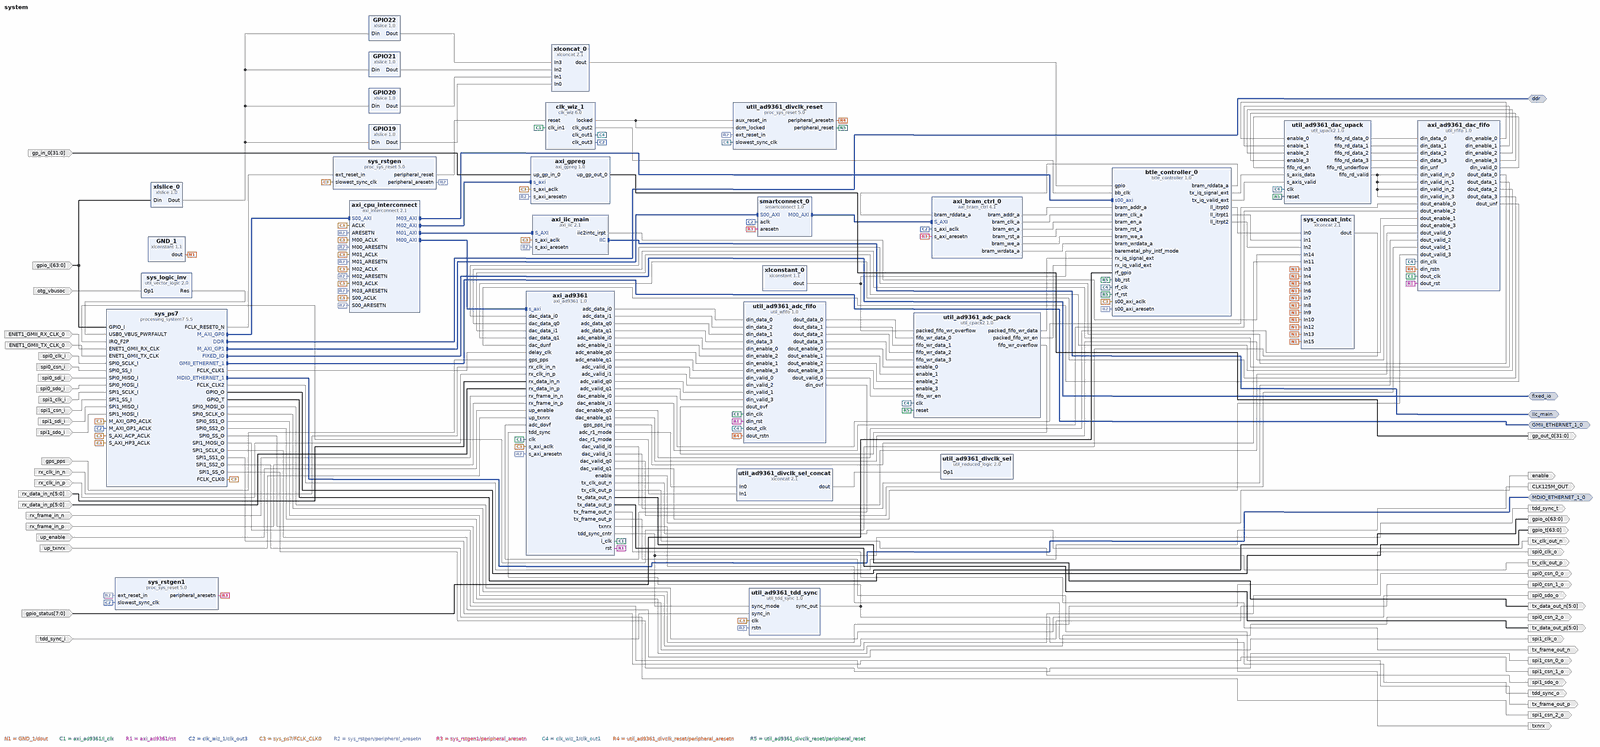
[diagram p0: block diagram of the top level, whole]
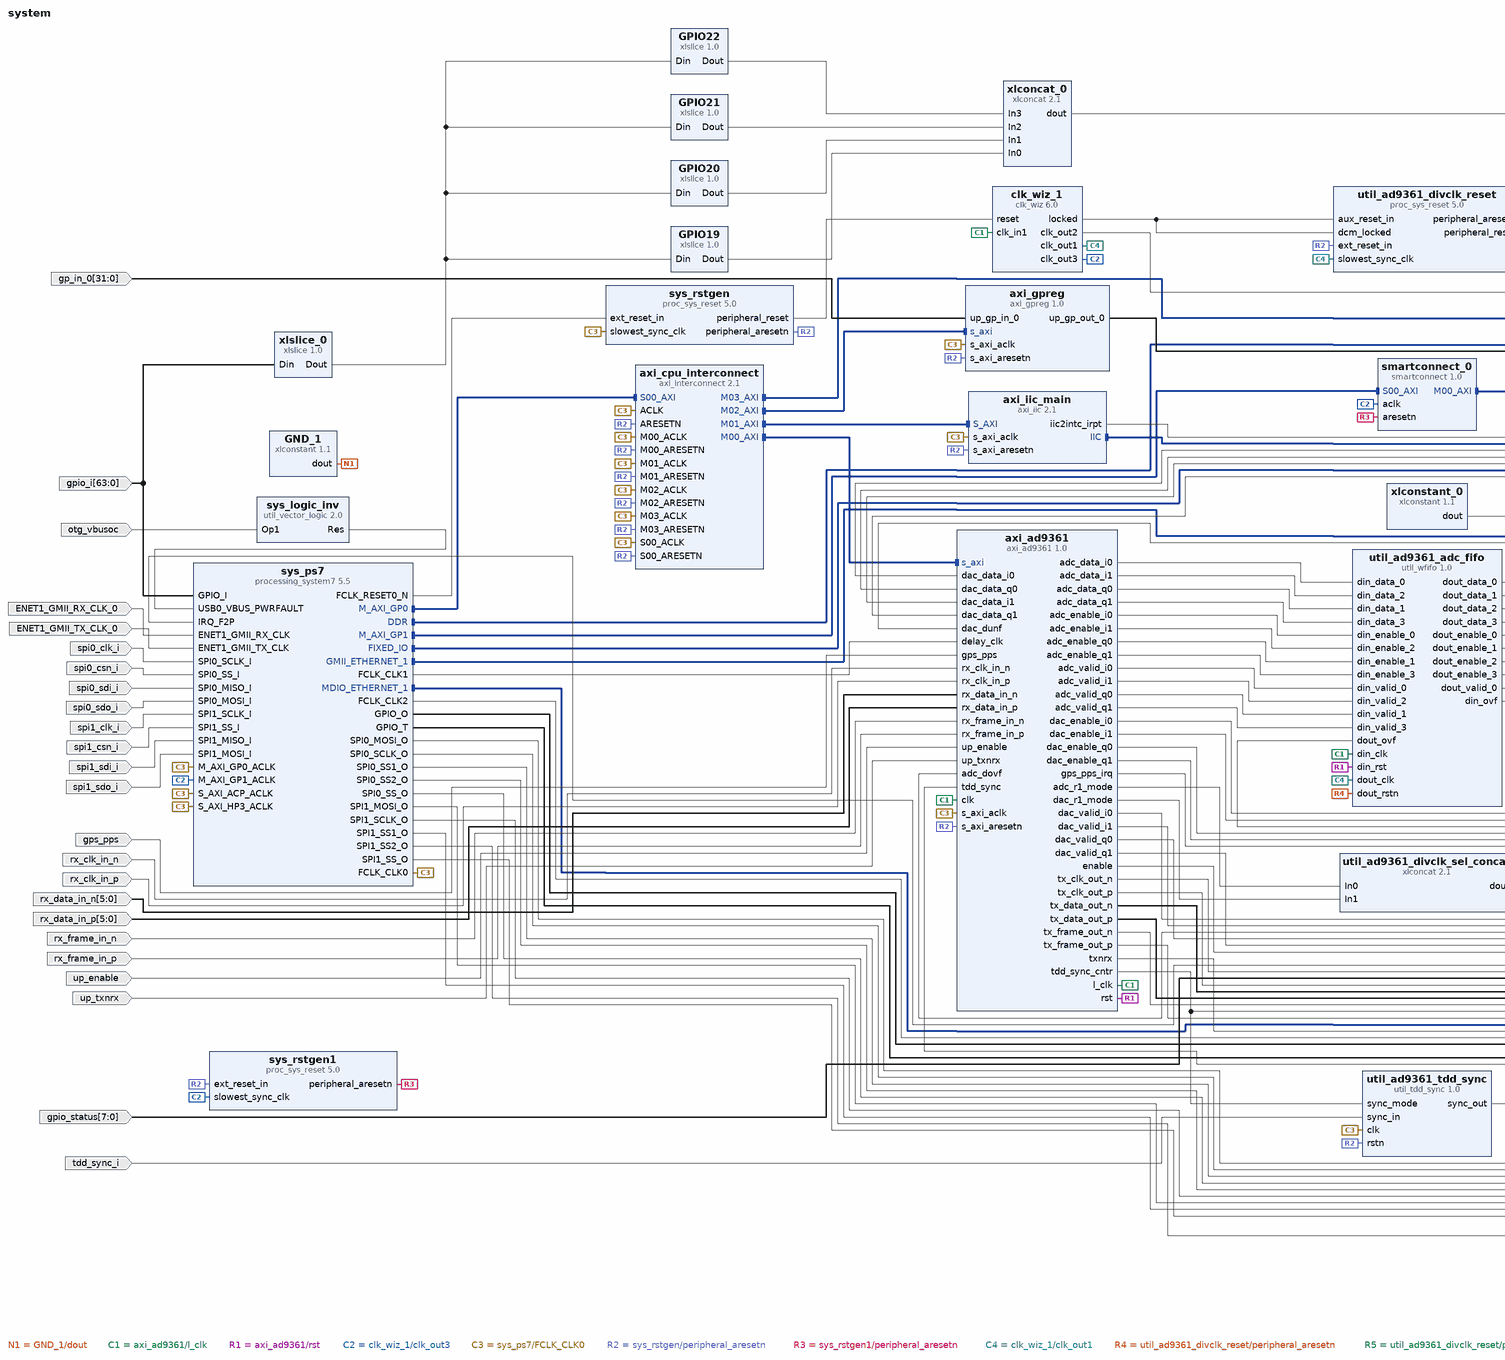
[diagram p1: block diagram of the top level, left part]
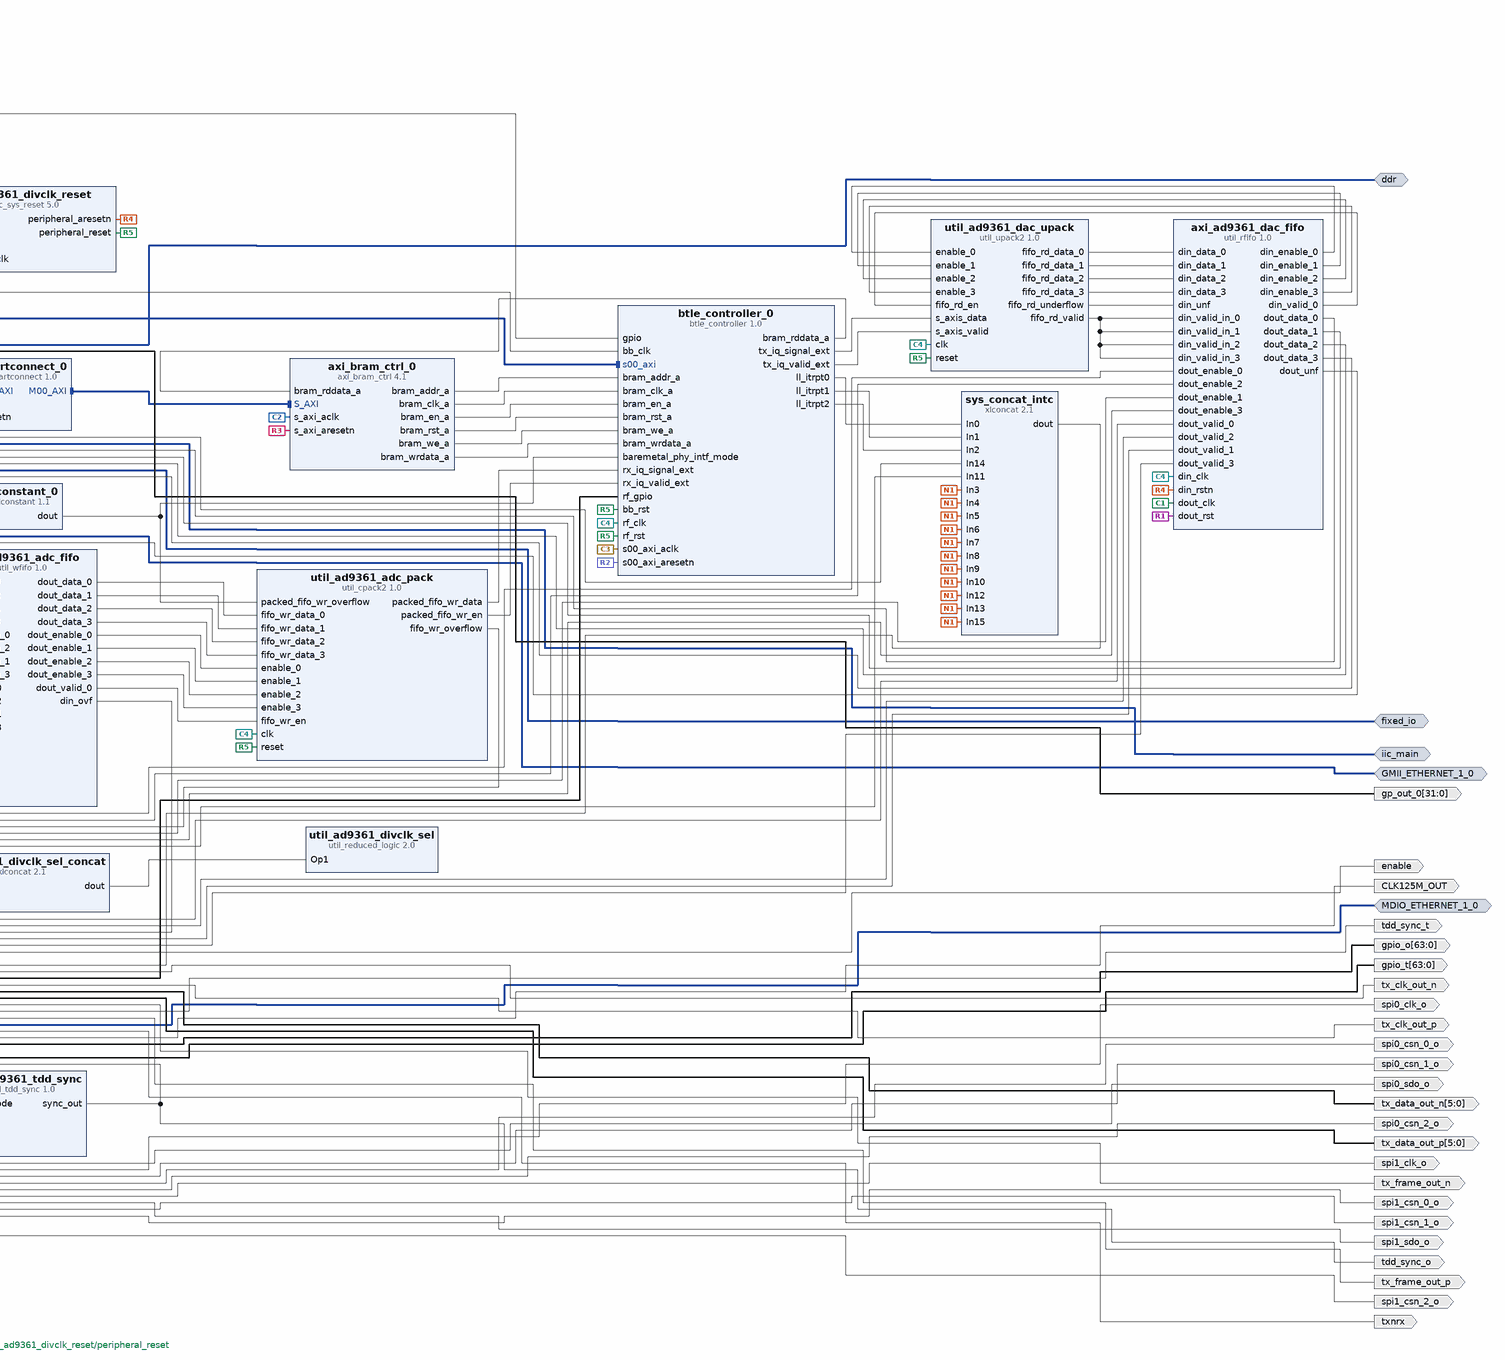
[diagram p2: block diagram of the top level, right part]
# Vivado block design system, xc7z020clg400-1, Vivado 2022.2
create_bd_design system

create_bd_intf_port -mode Master -vlnv xilinx.com:interface:ddrx_rtl:1.0 ddr
create_bd_intf_port -mode Master -vlnv xilinx.com:interface:iic_rtl:1.0 iic_main
create_bd_intf_port -mode Master -vlnv xilinx.com:display_processing_system7:fixedio_rtl:1.0 fixed_io
create_bd_intf_port -mode Master -vlnv xilinx.com:interface:gmii_rtl:1.0 GMII_ETHERNET_1_0
create_bd_intf_port -mode Master -vlnv xilinx.com:interface:mdio_rtl:1.0 MDIO_ETHERNET_1_0
create_bd_port -dir O spi0_csn_2_o
create_bd_port -dir O spi0_csn_1_o
create_bd_port -dir O spi0_csn_0_o
create_bd_port -dir I spi0_csn_i
create_bd_port -dir I spi0_clk_i
create_bd_port -dir O spi0_clk_o
create_bd_port -dir I spi0_sdo_i
create_bd_port -dir O spi0_sdo_o
create_bd_port -dir I spi0_sdi_i
create_bd_port -dir O spi1_csn_2_o
create_bd_port -dir O spi1_csn_1_o
create_bd_port -dir O spi1_csn_0_o
create_bd_port -dir I spi1_csn_i
create_bd_port -dir I spi1_clk_i
create_bd_port -dir O spi1_clk_o
create_bd_port -dir I spi1_sdo_i
create_bd_port -dir O spi1_sdo_o
create_bd_port -dir I spi1_sdi_i
create_bd_port -dir I -from 63 -to 0 gpio_i
create_bd_port -dir O -from 63 -to 0 gpio_o
create_bd_port -dir O -from 63 -to 0 gpio_t
create_bd_port -dir I otg_vbusoc
create_bd_port -dir O enable
create_bd_port -dir O txnrx
create_bd_port -dir I up_enable
create_bd_port -dir I up_txnrx
create_bd_port -dir O tdd_sync_o
create_bd_port -dir I tdd_sync_i
create_bd_port -dir O tdd_sync_t
create_bd_port -dir I gps_pps
create_bd_port -dir I -from 31 -to 0 gp_in_0
create_bd_port -dir O -from 31 -to 0 gp_out_0
create_bd_port -dir I rx_clk_in_p
create_bd_port -dir I rx_clk_in_n
create_bd_port -dir I rx_frame_in_p
create_bd_port -dir I rx_frame_in_n
create_bd_port -dir I -from 5 -to 0 rx_data_in_p
create_bd_port -dir I -from 5 -to 0 rx_data_in_n
create_bd_port -dir O tx_clk_out_p
create_bd_port -dir O tx_clk_out_n
create_bd_port -dir O tx_frame_out_p
create_bd_port -dir O tx_frame_out_n
create_bd_port -dir O -from 5 -to 0 tx_data_out_p
create_bd_port -dir O -from 5 -to 0 tx_data_out_n
create_bd_port -dir I -from 7 -to 0 gpio_status
create_bd_port -dir O CLK125M_OUT
create_bd_port -dir I -type clk ENET1_GMII_RX_CLK_0
create_bd_port -dir I -type clk ENET1_GMII_TX_CLK_0

create_bd_cell -type ip -vlnv xilinx.com:ip:processing_system7:5.5 sys_ps7
set_property -dict [list \
  CONFIG.PCW_ENET0_ENET0_IO {MIO 16 .. 27} \
  CONFIG.PCW_ENET0_GRP_MDIO_ENABLE 1 \
  CONFIG.PCW_ENET0_GRP_MDIO_IO {MIO 52 .. 53} \
  CONFIG.PCW_ENET0_PERIPHERAL_ENABLE 1 \
  CONFIG.PCW_ENET0_RESET_ENABLE 1 \
  CONFIG.PCW_ENET0_RESET_IO {MIO 46} \
  CONFIG.PCW_ENET1_ENET1_IO EMIO \
  CONFIG.PCW_ENET1_GRP_MDIO_ENABLE 1 \
  CONFIG.PCW_ENET1_GRP_MDIO_IO EMIO \
  CONFIG.PCW_ENET1_PERIPHERAL_ENABLE 1 \
  CONFIG.PCW_ENET1_RESET_ENABLE 1 \
  CONFIG.PCW_ENET1_RESET_IO {MIO 51} \
  CONFIG.PCW_ENET_RESET_ENABLE 1 \
  CONFIG.PCW_ENET_RESET_SELECT {Separate reset pins} \
  CONFIG.PCW_EN_CLK1_PORT 1 \
  CONFIG.PCW_EN_CLK2_PORT 1 \
  CONFIG.PCW_EN_RST1_PORT 1 \
  CONFIG.PCW_EN_RST2_PORT 1 \
  CONFIG.PCW_FCLK_CLK1_BUF TRUE \
  CONFIG.PCW_FCLK_CLK2_BUF TRUE \
  CONFIG.PCW_FPGA0_PERIPHERAL_FREQMHZ 100.0 \
  CONFIG.PCW_FPGA1_PERIPHERAL_FREQMHZ 200.0 \
  CONFIG.PCW_FPGA2_PERIPHERAL_FREQMHZ 125 \
  CONFIG.PCW_FPGA_FCLK1_ENABLE 1 \
  CONFIG.PCW_FPGA_FCLK2_ENABLE 1 \
  CONFIG.PCW_GPIO_EMIO_GPIO_ENABLE 1 \
  CONFIG.PCW_GPIO_EMIO_GPIO_IO 64 \
  CONFIG.PCW_GPIO_MIO_GPIO_ENABLE 1 \
  CONFIG.PCW_GPIO_MIO_GPIO_IO MIO \
  CONFIG.PCW_I2C_RESET_ENABLE 1 \
  CONFIG.PCW_IRQ_F2P_INTR 1 \
  CONFIG.PCW_IRQ_F2P_MODE REVERSE \
  CONFIG.PCW_M_AXI_GP1_ENABLE_STATIC_REMAP 1 \
  CONFIG.PCW_M_AXI_GP1_THREAD_ID_WIDTH 6 \
  CONFIG.PCW_PRESET_BANK1_VOLTAGE {LVCMOS 1.8V} \
  CONFIG.PCW_QSPI_GRP_SINGLE_SS_ENABLE 1 \
  CONFIG.PCW_QSPI_GRP_SINGLE_SS_IO {MIO 1 .. 6} \
  CONFIG.PCW_QSPI_PERIPHERAL_ENABLE 1 \
  CONFIG.PCW_QSPI_QSPI_IO {MIO 1 .. 6} \
  CONFIG.PCW_SD0_GRP_CD_ENABLE 0 \
  CONFIG.PCW_SD0_GRP_WP_ENABLE 0 \
  CONFIG.PCW_SD0_PERIPHERAL_ENABLE 1 \
  CONFIG.PCW_SD0_SD0_IO {MIO 40 .. 45} \
  CONFIG.PCW_SDIO_PERIPHERAL_FREQMHZ 50 \
  CONFIG.PCW_SINGLE_QSPI_DATA_MODE x4 \
  CONFIG.PCW_SPI0_PERIPHERAL_ENABLE 1 \
  CONFIG.PCW_SPI0_SPI0_IO EMIO \
  CONFIG.PCW_SPI1_PERIPHERAL_ENABLE 1 \
  CONFIG.PCW_SPI1_SPI1_IO EMIO \
  CONFIG.PCW_UART1_PERIPHERAL_ENABLE 1 \
  CONFIG.PCW_UART1_UART1_IO {MIO 48 .. 49} \
  CONFIG.PCW_UART_PERIPHERAL_FREQMHZ 100 \
  CONFIG.PCW_UIPARAM_DDR_PARTNO {MT41J256M16 RE-125} \
  CONFIG.PCW_USB0_PERIPHERAL_ENABLE 1 \
  CONFIG.PCW_USB0_RESET_ENABLE 1 \
  CONFIG.PCW_USB0_RESET_IO {MIO 47} \
  CONFIG.PCW_USB0_USB0_IO {MIO 28 .. 39} \
  CONFIG.PCW_USB_RESET_ENABLE 1 \
  CONFIG.PCW_USB_RESET_SELECT {Share reset pin} \
  CONFIG.PCW_USE_DEFAULT_ACP_USER_VAL 1 \
  CONFIG.PCW_USE_FABRIC_INTERRUPT 1 \
  CONFIG.PCW_USE_M_AXI_GP1 1 \
  CONFIG.PCW_USE_S_AXI_ACP 1 \
  CONFIG.PCW_USE_S_AXI_HP3 1 \
] [get_bd_cells sys_ps7]
# 238 more settings of sys_ps7 are not shown: defaults, MIO pin electricals, DDR timing, and values the tool derives
create_bd_cell -type ip -vlnv xilinx.com:ip:proc_sys_reset:5.0 sys_rstgen
set_property -dict {CONFIG.C_EXT_RST_WIDTH 1} [get_bd_cells sys_rstgen]
create_bd_cell -type ip -vlnv analog.com:user:axi_ad9361:1.0 axi_ad9361
set_property -dict [list \
  CONFIG.ADC_DATAFORMAT_DISABLE 0 \
  CONFIG.ADC_DATAPATH_DISABLE 0 \
  CONFIG.ADC_DCFILTER_DISABLE 0 \
  CONFIG.ADC_INIT_DELAY 30 \
  CONFIG.ADC_IQCORRECTION_DISABLE 0 \
  CONFIG.ADC_USERPORTS_DISABLE 0 \
  CONFIG.CMOS_OR_LVDS_N 0 \
  CONFIG.DAC_DATAPATH_DISABLE 0 \
  CONFIG.DAC_DDS_DISABLE 1 \
  CONFIG.DAC_IODELAY_ENABLE 0 \
  CONFIG.DAC_IQCORRECTION_DISABLE 0 \
  CONFIG.DAC_USERPORTS_DISABLE 0 \
  CONFIG.ID 0 \
  CONFIG.MIMO_ENABLE 1 \
  CONFIG.MODE_1R1T 0 \
  CONFIG.TDD_DISABLE 1 \
] [get_bd_cells axi_ad9361]
create_bd_cell -type ip -vlnv analog.com:user:util_tdd_sync:1.0 util_ad9361_tdd_sync
set_property -dict {CONFIG.TDD_SYNC_PERIOD 10000000} [get_bd_cells util_ad9361_tdd_sync]
create_bd_cell -type ip -vlnv xilinx.com:ip:util_reduced_logic:2.0 util_ad9361_divclk_sel
set_property -dict {CONFIG.C_SIZE 2} [get_bd_cells util_ad9361_divclk_sel]
create_bd_cell -type ip -vlnv xilinx.com:ip:proc_sys_reset:5.0 util_ad9361_divclk_reset
create_bd_cell -type ip -vlnv analog.com:user:util_wfifo:1.0 util_ad9361_adc_fifo
set_property -dict [list \
  CONFIG.DIN_ADDRESS_WIDTH 4 \
  CONFIG.DIN_DATA_WIDTH 16 \
  CONFIG.DOUT_DATA_WIDTH 16 \
  CONFIG.NUM_OF_CHANNELS 4 \
] [get_bd_cells util_ad9361_adc_fifo]
create_bd_cell -type ip -vlnv analog.com:user:util_cpack2:1.0 util_ad9361_adc_pack
set_property -dict {CONFIG.NUM_OF_CHANNELS 4 CONFIG.SAMPLE_DATA_WIDTH 16} [get_bd_cells util_ad9361_adc_pack]
create_bd_cell -type ip -vlnv analog.com:user:util_rfifo:1.0 axi_ad9361_dac_fifo
set_property -dict [list \
  CONFIG.DIN_ADDRESS_WIDTH 4 \
  CONFIG.DIN_DATA_WIDTH 16 \
  CONFIG.DOUT_DATA_WIDTH 16 \
] [get_bd_cells axi_ad9361_dac_fifo]
create_bd_cell -type ip -vlnv analog.com:user:util_upack2:1.0 util_ad9361_dac_upack
set_property -dict {CONFIG.NUM_OF_CHANNELS 4 CONFIG.SAMPLE_DATA_WIDTH 16} [get_bd_cells util_ad9361_dac_upack]
create_bd_cell -type ip -vlnv analog.com:user:axi_gpreg:1.0 axi_gpreg
set_property -dict {CONFIG.NUM_OF_CLK_MONS 0 CONFIG.NUM_OF_IO 1} [get_bd_cells axi_gpreg]
create_bd_cell -type ip -vlnv xilinx.com:ip:xlconstant:1.1 GND_1
set_property -dict {CONFIG.CONST_VAL 0 CONFIG.CONST_WIDTH 1} [get_bd_cells GND_1]
create_bd_cell -type ip -vlnv xilinx.com:ip:axi_interconnect:2.1 axi_cpu_interconnect
set_property -dict {CONFIG.NUM_MI 4} [get_bd_cells axi_cpu_interconnect]
create_bd_cell -type ip -vlnv xilinx.com:ip:axi_iic:2.1 axi_iic_main
set_property -dict {CONFIG.IIC_BOARD_INTERFACE Custom CONFIG.USE_BOARD_FLOW true} [get_bd_cells axi_iic_main]
create_bd_cell -type ip -vlnv xilinx.com:ip:xlconcat:2.1 sys_concat_intc
set_property -dict {CONFIG.NUM_PORTS 16 CONFIG.dout_width 16} [get_bd_cells sys_concat_intc]
create_bd_cell -type ip -vlnv xilinx.com:ip:util_vector_logic:2.0 sys_logic_inv
set_property -dict {CONFIG.C_OPERATION not CONFIG.C_SIZE 1} [get_bd_cells sys_logic_inv]
create_bd_cell -type ip -vlnv xilinx.com:ip:xlconcat:2.1 util_ad9361_divclk_sel_concat
set_property -dict {CONFIG.NUM_PORTS 2} [get_bd_cells util_ad9361_divclk_sel_concat]
create_bd_cell -type ip -vlnv user.org:user:btle_controller:1.0 btle_controller_0
create_bd_cell -type ip -vlnv xilinx.com:ip:xlconstant:1.1 xlconstant_0
set_property -dict {CONFIG.CONST_VAL 0} [get_bd_cells xlconstant_0]
create_bd_cell -type ip -vlnv xilinx.com:ip:xlslice:1.0 xlslice_0
set_property -dict {CONFIG.DIN_FROM 25 CONFIG.DIN_WIDTH 64} [get_bd_cells xlslice_0]
create_bd_cell -type ip -vlnv xilinx.com:ip:xlslice:1.0 GPIO21
set_property -dict {CONFIG.DIN_FROM 20 CONFIG.DIN_TO 20 CONFIG.DIN_WIDTH 26} [get_bd_cells GPIO21]
create_bd_cell -type ip -vlnv xilinx.com:ip:xlslice:1.0 GPIO22
set_property -dict {CONFIG.DIN_FROM 21 CONFIG.DIN_TO 21 CONFIG.DIN_WIDTH 26} [get_bd_cells GPIO22]
create_bd_cell -type ip -vlnv xilinx.com:ip:xlslice:1.0 GPIO20
set_property -dict {CONFIG.DIN_FROM 19 CONFIG.DIN_TO 19 CONFIG.DIN_WIDTH 26} [get_bd_cells GPIO20]
create_bd_cell -type ip -vlnv xilinx.com:ip:xlslice:1.0 GPIO19
set_property -dict {CONFIG.DIN_FROM 18 CONFIG.DIN_TO 18 CONFIG.DIN_WIDTH 26} [get_bd_cells GPIO19]
create_bd_cell -type ip -vlnv xilinx.com:ip:xlconcat:2.1 xlconcat_0
set_property -dict {CONFIG.NUM_PORTS 4} [get_bd_cells xlconcat_0]
create_bd_cell -type ip -vlnv xilinx.com:ip:clk_wiz:6.0 clk_wiz_1
set_property -dict [list \
  CONFIG.CLKIN1_JITTER_PS 312.5 \
  CONFIG.CLKOUT1_JITTER 434.696 \
  CONFIG.CLKOUT1_PHASE_ERROR 213.874 \
  CONFIG.CLKOUT1_REQUESTED_OUT_FREQ 8 \
  CONFIG.CLKOUT2_JITTER 379.346 \
  CONFIG.CLKOUT2_PHASE_ERROR 213.874 \
  CONFIG.CLKOUT2_REQUESTED_OUT_FREQ 16 \
  CONFIG.CLKOUT2_USED true \
  CONFIG.CLKOUT3_JITTER 185.867 \
  CONFIG.CLKOUT3_PHASE_ERROR 213.874 \
  CONFIG.CLKOUT3_REQUESTED_OUT_FREQ 192 \
  CONFIG.CLKOUT3_USED true \
  CONFIG.MMCM_CLKFBOUT_MULT_F 30.000 \
  CONFIG.MMCM_CLKIN1_PERIOD 31.250 \
  CONFIG.MMCM_CLKIN2_PERIOD 10.0 \
  CONFIG.MMCM_CLKOUT0_DIVIDE_F 120.000 \
  CONFIG.MMCM_CLKOUT1_DIVIDE 60 \
  CONFIG.MMCM_CLKOUT2_DIVIDE 5 \
  CONFIG.NUM_OUT_CLKS 3 \
  CONFIG.PRIM_IN_FREQ 32 \
] [get_bd_cells clk_wiz_1]
create_bd_cell -type ip -vlnv xilinx.com:ip:axi_bram_ctrl:4.1 axi_bram_ctrl_0
set_property -dict {CONFIG.READ_LATENCY 4 CONFIG.SINGLE_PORT_BRAM 1 CONFIG.SUPPORTS_NARROW_BURST 1} [get_bd_cells axi_bram_ctrl_0]
create_bd_cell -type ip -vlnv xilinx.com:ip:smartconnect:1.0 smartconnect_0
set_property -dict {CONFIG.NUM_SI 1} [get_bd_cells smartconnect_0]
create_bd_cell -type ip -vlnv xilinx.com:ip:proc_sys_reset:5.0 sys_rstgen1
set_property -dict {CONFIG.C_EXT_RST_WIDTH 1} [get_bd_cells sys_rstgen1]

# ---- connections ----

connect_bd_intf_net [get_bd_intf_pins axi_cpu_interconnect/S00_AXI] [get_bd_intf_pins sys_ps7/M_AXI_GP0]
connect_bd_intf_net [get_bd_intf_pins axi_ad9361/s_axi] [get_bd_intf_pins axi_cpu_interconnect/M00_AXI]
connect_bd_intf_net [get_bd_intf_pins axi_cpu_interconnect/M01_AXI] [get_bd_intf_pins axi_iic_main/S_AXI]
connect_bd_intf_net [get_bd_intf_pins axi_gpreg/s_axi] [get_bd_intf_pins axi_cpu_interconnect/M02_AXI]
connect_bd_intf_net [get_bd_intf_pins btle_controller_0/s00_axi] [get_bd_intf_pins axi_cpu_interconnect/M03_AXI]
connect_bd_intf_net [get_bd_intf_ports iic_main] [get_bd_intf_pins axi_iic_main/IIC]
connect_bd_intf_net [get_bd_intf_pins smartconnect_0/M00_AXI] [get_bd_intf_pins axi_bram_ctrl_0/S_AXI]
connect_bd_intf_net [get_bd_intf_ports ddr] [get_bd_intf_pins sys_ps7/DDR]
connect_bd_intf_net [get_bd_intf_ports fixed_io] [get_bd_intf_pins sys_ps7/FIXED_IO]
connect_bd_intf_net [get_bd_intf_ports GMII_ETHERNET_1_0] [get_bd_intf_pins sys_ps7/GMII_ETHERNET_1]
connect_bd_intf_net [get_bd_intf_ports MDIO_ETHERNET_1_0] [get_bd_intf_pins sys_ps7/MDIO_ETHERNET_1]
connect_bd_intf_net [get_bd_intf_pins smartconnect_0/S00_AXI] [get_bd_intf_pins sys_ps7/M_AXI_GP1]
connect_bd_net -net ENET1_GMII_RX_CLK_0_1 [get_bd_ports ENET1_GMII_RX_CLK_0] [get_bd_pins sys_ps7/ENET1_GMII_RX_CLK]
connect_bd_net -net ENET1_GMII_TX_CLK_0_1 [get_bd_ports ENET1_GMII_TX_CLK_0] [get_bd_pins sys_ps7/ENET1_GMII_TX_CLK]
connect_bd_net [get_bd_pins GND_1/dout] \
  [get_bd_pins sys_concat_intc/In8] [get_bd_pins sys_concat_intc/In9] [get_bd_pins sys_concat_intc/In10] \
  [get_bd_pins sys_concat_intc/In15] [get_bd_pins sys_concat_intc/In13] [get_bd_pins sys_concat_intc/In12] \
  [get_bd_pins sys_concat_intc/In4] [get_bd_pins sys_concat_intc/In5] [get_bd_pins sys_concat_intc/In6] \
  [get_bd_pins sys_concat_intc/In3] [get_bd_pins sys_concat_intc/In7]
connect_bd_net [get_bd_pins GPIO19/Dout] [get_bd_pins xlconcat_0/In0]
connect_bd_net [get_bd_pins GPIO20/Dout] [get_bd_pins xlconcat_0/In1]
connect_bd_net [get_bd_pins GPIO21/Dout] [get_bd_pins xlconcat_0/In2]
connect_bd_net [get_bd_pins GPIO22/Dout] [get_bd_pins xlconcat_0/In3]
connect_bd_net [get_bd_pins axi_ad9361/adc_data_i0] [get_bd_pins util_ad9361_adc_fifo/din_data_0]
connect_bd_net [get_bd_pins axi_ad9361/adc_data_i1] [get_bd_pins util_ad9361_adc_fifo/din_data_2]
connect_bd_net [get_bd_pins axi_ad9361/adc_data_q0] [get_bd_pins util_ad9361_adc_fifo/din_data_1]
connect_bd_net [get_bd_pins axi_ad9361/adc_data_q1] [get_bd_pins util_ad9361_adc_fifo/din_data_3]
connect_bd_net [get_bd_pins axi_ad9361/adc_enable_i0] [get_bd_pins util_ad9361_adc_fifo/din_enable_0]
connect_bd_net [get_bd_pins axi_ad9361/adc_enable_i1] [get_bd_pins util_ad9361_adc_fifo/din_enable_2]
connect_bd_net [get_bd_pins axi_ad9361/adc_enable_q0] [get_bd_pins util_ad9361_adc_fifo/din_enable_1]
connect_bd_net [get_bd_pins axi_ad9361/adc_enable_q1] [get_bd_pins util_ad9361_adc_fifo/din_enable_3]
connect_bd_net [get_bd_pins axi_ad9361/adc_r1_mode] [get_bd_pins util_ad9361_divclk_sel_concat/In0]
connect_bd_net [get_bd_pins axi_ad9361/adc_valid_i0] [get_bd_pins util_ad9361_adc_fifo/din_valid_0]
connect_bd_net [get_bd_pins axi_ad9361/adc_valid_i1] [get_bd_pins util_ad9361_adc_fifo/din_valid_2]
connect_bd_net [get_bd_pins axi_ad9361/adc_valid_q0] [get_bd_pins util_ad9361_adc_fifo/din_valid_1]
connect_bd_net [get_bd_pins axi_ad9361/adc_valid_q1] [get_bd_pins util_ad9361_adc_fifo/din_valid_3]
connect_bd_net [get_bd_pins axi_ad9361/dac_enable_i0] [get_bd_pins axi_ad9361_dac_fifo/dout_enable_0]
connect_bd_net [get_bd_pins axi_ad9361/dac_enable_i1] [get_bd_pins axi_ad9361_dac_fifo/dout_enable_2]
connect_bd_net [get_bd_pins axi_ad9361/dac_enable_q0] [get_bd_pins axi_ad9361_dac_fifo/dout_enable_1]
connect_bd_net [get_bd_pins axi_ad9361/dac_enable_q1] [get_bd_pins axi_ad9361_dac_fifo/dout_enable_3]
connect_bd_net [get_bd_pins axi_ad9361_dac_fifo/din_enable_0] [get_bd_pins util_ad9361_dac_upack/enable_0]
connect_bd_net [get_bd_pins axi_ad9361_dac_fifo/din_enable_1] [get_bd_pins util_ad9361_dac_upack/enable_1]
connect_bd_net [get_bd_pins axi_ad9361_dac_fifo/din_enable_2] [get_bd_pins util_ad9361_dac_upack/enable_2]
connect_bd_net [get_bd_pins axi_ad9361_dac_fifo/din_enable_3] [get_bd_pins util_ad9361_dac_upack/enable_3]
connect_bd_net [get_bd_pins axi_ad9361_dac_fifo/din_valid_0] [get_bd_pins util_ad9361_dac_upack/fifo_rd_en]
connect_bd_net [get_bd_pins axi_ad9361_dac_fifo/dout_data_0] [get_bd_pins axi_ad9361/dac_data_i0]
connect_bd_net [get_bd_pins axi_ad9361_dac_fifo/dout_data_1] [get_bd_pins axi_ad9361/dac_data_q0]
connect_bd_net [get_bd_pins axi_ad9361_dac_fifo/dout_data_2] [get_bd_pins axi_ad9361/dac_data_i1]
connect_bd_net [get_bd_pins axi_ad9361_dac_fifo/dout_data_3] [get_bd_pins axi_ad9361/dac_data_q1]
connect_bd_net [get_bd_pins axi_ad9361_dac_fifo/dout_unf] [get_bd_pins axi_ad9361/dac_dunf]
connect_bd_net [get_bd_pins axi_ad9361/dac_r1_mode] [get_bd_pins util_ad9361_divclk_sel_concat/In1]
connect_bd_net [get_bd_pins axi_ad9361/dac_valid_i0] [get_bd_pins axi_ad9361_dac_fifo/dout_valid_0]
connect_bd_net [get_bd_pins axi_ad9361/dac_valid_i1] [get_bd_pins axi_ad9361_dac_fifo/dout_valid_2]
connect_bd_net [get_bd_pins axi_ad9361/dac_valid_q0] [get_bd_pins axi_ad9361_dac_fifo/dout_valid_1]
connect_bd_net [get_bd_pins axi_ad9361/dac_valid_q1] [get_bd_pins axi_ad9361_dac_fifo/dout_valid_3]
connect_bd_net [get_bd_pins axi_ad9361/enable] [get_bd_ports enable]
connect_bd_net [get_bd_pins axi_ad9361/gps_pps_irq] [get_bd_pins sys_concat_intc/In11]
connect_bd_net [get_bd_pins axi_ad9361/l_clk] \
  [get_bd_pins axi_ad9361/clk] [get_bd_pins util_ad9361_adc_fifo/din_clk] [get_bd_pins axi_ad9361_dac_fifo/dout_clk] \
  [get_bd_pins clk_wiz_1/clk_in1]
connect_bd_net [get_bd_pins axi_ad9361/rst] [get_bd_pins util_ad9361_adc_fifo/din_rst] [get_bd_pins axi_ad9361_dac_fifo/dout_rst]
connect_bd_net [get_bd_pins axi_ad9361/tdd_sync_cntr] [get_bd_pins util_ad9361_tdd_sync/sync_mode] [get_bd_ports tdd_sync_t]
connect_bd_net [get_bd_pins axi_ad9361/tx_clk_out_n] [get_bd_ports tx_clk_out_n]
connect_bd_net [get_bd_pins axi_ad9361/tx_clk_out_p] [get_bd_ports tx_clk_out_p]
connect_bd_net [get_bd_pins axi_ad9361/tx_data_out_n] [get_bd_ports tx_data_out_n]
connect_bd_net [get_bd_pins axi_ad9361/tx_data_out_p] [get_bd_ports tx_data_out_p]
connect_bd_net [get_bd_pins axi_ad9361/tx_frame_out_n] [get_bd_ports tx_frame_out_n]
connect_bd_net [get_bd_pins axi_ad9361/tx_frame_out_p] [get_bd_ports tx_frame_out_p]
connect_bd_net [get_bd_pins axi_ad9361/txnrx] [get_bd_ports txnrx]
connect_bd_net [get_bd_pins axi_bram_ctrl_0/bram_addr_a] [get_bd_pins btle_controller_0/bram_addr_a]
connect_bd_net [get_bd_pins axi_bram_ctrl_0/bram_clk_a] [get_bd_pins btle_controller_0/bram_clk_a]
connect_bd_net [get_bd_pins axi_bram_ctrl_0/bram_en_a] [get_bd_pins btle_controller_0/bram_en_a]
connect_bd_net [get_bd_pins axi_bram_ctrl_0/bram_rst_a] [get_bd_pins btle_controller_0/bram_rst_a]
connect_bd_net [get_bd_pins axi_bram_ctrl_0/bram_we_a] [get_bd_pins btle_controller_0/bram_we_a]
connect_bd_net [get_bd_pins axi_bram_ctrl_0/bram_wrdata_a] [get_bd_pins btle_controller_0/bram_wrdata_a]
connect_bd_net [get_bd_pins axi_gpreg/up_gp_out_0] [get_bd_ports gp_out_0]
connect_bd_net [get_bd_pins axi_iic_main/iic2intc_irpt] [get_bd_pins sys_concat_intc/In14]
connect_bd_net [get_bd_pins btle_controller_0/bram_rddata_a] [get_bd_pins axi_bram_ctrl_0/bram_rddata_a]
connect_bd_net [get_bd_pins btle_controller_0/ll_itrpt0] [get_bd_pins sys_concat_intc/In0]
connect_bd_net [get_bd_pins btle_controller_0/ll_itrpt1] [get_bd_pins sys_concat_intc/In1]
connect_bd_net [get_bd_pins btle_controller_0/ll_itrpt2] [get_bd_pins sys_concat_intc/In2]
connect_bd_net -net btle_controller_0_tx_iq_signal [get_bd_pins btle_controller_0/tx_iq_signal_ext] [get_bd_pins util_ad9361_dac_upack/s_axis_data]
connect_bd_net -net btle_controller_0_tx_iq_valid [get_bd_pins btle_controller_0/tx_iq_valid_ext] [get_bd_pins util_ad9361_dac_upack/s_axis_valid]
connect_bd_net -net clk_wiz_0_locked [get_bd_pins clk_wiz_1/locked] \
  [get_bd_pins util_ad9361_divclk_reset/aux_reset_in] [get_bd_pins util_ad9361_divclk_reset/dcm_locked]
connect_bd_net [get_bd_pins clk_wiz_1/clk_out2] [get_bd_pins btle_controller_0/bb_clk]
connect_bd_net [get_bd_pins clk_wiz_1/clk_out3] \
  [get_bd_pins sys_rstgen1/slowest_sync_clk] [get_bd_pins smartconnect_0/aclk] [get_bd_pins axi_bram_ctrl_0/s_axi_aclk] \
  [get_bd_pins sys_ps7/M_AXI_GP1_ACLK]
connect_bd_net -net gp_in_0_1 [get_bd_ports gp_in_0] [get_bd_pins axi_gpreg/up_gp_in_0]
connect_bd_net [get_bd_ports gpio_i] [get_bd_pins sys_ps7/GPIO_I] [get_bd_pins xlslice_0/Din]
connect_bd_net [get_bd_ports gpio_status] [get_bd_pins btle_controller_0/rf_gpio]
connect_bd_net [get_bd_ports gps_pps] [get_bd_pins axi_ad9361/gps_pps]
connect_bd_net [get_bd_ports otg_vbusoc] [get_bd_pins sys_logic_inv/Op1]
connect_bd_net [get_bd_ports rx_clk_in_n] [get_bd_pins axi_ad9361/rx_clk_in_n]
connect_bd_net [get_bd_ports rx_clk_in_p] [get_bd_pins axi_ad9361/rx_clk_in_p]
connect_bd_net [get_bd_ports rx_data_in_n] [get_bd_pins axi_ad9361/rx_data_in_n]
connect_bd_net [get_bd_ports rx_data_in_p] [get_bd_pins axi_ad9361/rx_data_in_p]
connect_bd_net [get_bd_ports rx_frame_in_n] [get_bd_pins axi_ad9361/rx_frame_in_n]
connect_bd_net [get_bd_ports rx_frame_in_p] [get_bd_pins axi_ad9361/rx_frame_in_p]
connect_bd_net [get_bd_ports spi0_clk_i] [get_bd_pins sys_ps7/SPI0_SCLK_I]
connect_bd_net [get_bd_ports spi0_csn_i] [get_bd_pins sys_ps7/SPI0_SS_I]
connect_bd_net [get_bd_ports spi0_sdi_i] [get_bd_pins sys_ps7/SPI0_MISO_I]
connect_bd_net [get_bd_ports spi0_sdo_i] [get_bd_pins sys_ps7/SPI0_MOSI_I]
connect_bd_net [get_bd_ports spi1_clk_i] [get_bd_pins sys_ps7/SPI1_SCLK_I]
connect_bd_net [get_bd_ports spi1_csn_i] [get_bd_pins sys_ps7/SPI1_SS_I]
connect_bd_net [get_bd_ports spi1_sdi_i] [get_bd_pins sys_ps7/SPI1_MISO_I]
connect_bd_net [get_bd_ports spi1_sdo_i] [get_bd_pins sys_ps7/SPI1_MOSI_I]
connect_bd_net -net sys_200m_clk [get_bd_pins sys_ps7/FCLK_CLK1] [get_bd_pins axi_ad9361/delay_clk]
connect_bd_net [get_bd_pins sys_concat_intc/dout] [get_bd_pins sys_ps7/IRQ_F2P]
connect_bd_net -net sys_cpu_clk [get_bd_pins sys_ps7/FCLK_CLK0] \
  [get_bd_pins sys_rstgen/slowest_sync_clk] [get_bd_pins sys_ps7/M_AXI_GP0_ACLK] [get_bd_pins util_ad9361_tdd_sync/clk] \
  [get_bd_pins axi_ad9361/s_axi_aclk] [get_bd_pins axi_gpreg/s_axi_aclk] [get_bd_pins axi_cpu_interconnect/ACLK] \
  [get_bd_pins axi_cpu_interconnect/S00_ACLK] [get_bd_pins axi_cpu_interconnect/M00_ACLK] \
  [get_bd_pins axi_cpu_interconnect/M01_ACLK] [get_bd_pins axi_cpu_interconnect/M02_ACLK] \
  [get_bd_pins axi_iic_main/s_axi_aclk] [get_bd_pins sys_ps7/S_AXI_ACP_ACLK] [get_bd_pins sys_ps7/S_AXI_HP3_ACLK] \
  [get_bd_pins axi_cpu_interconnect/M03_ACLK] [get_bd_pins btle_controller_0/s00_axi_aclk]
connect_bd_net -net sys_cpu_resetn [get_bd_pins sys_rstgen/peripheral_aresetn] \
  [get_bd_pins util_ad9361_tdd_sync/rstn] [get_bd_pins util_ad9361_divclk_reset/ext_reset_in] \
  [get_bd_pins axi_ad9361/s_axi_aresetn] [get_bd_pins axi_gpreg/s_axi_aresetn] [get_bd_pins axi_cpu_interconnect/ARESETN] \
  [get_bd_pins axi_cpu_interconnect/S00_ARESETN] [get_bd_pins axi_cpu_interconnect/M00_ARESETN] \
  [get_bd_pins axi_cpu_interconnect/M01_ARESETN] [get_bd_pins axi_cpu_interconnect/M02_ARESETN] \
  [get_bd_pins axi_iic_main/s_axi_aresetn] [get_bd_pins axi_cpu_interconnect/M03_ARESETN] \
  [get_bd_pins btle_controller_0/s00_axi_aresetn] [get_bd_pins sys_rstgen1/ext_reset_in]
connect_bd_net [get_bd_pins sys_logic_inv/Res] [get_bd_pins sys_ps7/USB0_VBUS_PWRFAULT]
connect_bd_net [get_bd_pins sys_ps7/FCLK_CLK2] [get_bd_ports CLK125M_OUT]
connect_bd_net [get_bd_pins sys_ps7/FCLK_RESET0_N] [get_bd_pins sys_rstgen/ext_reset_in]
connect_bd_net [get_bd_pins sys_ps7/GPIO_O] [get_bd_ports gpio_o]
connect_bd_net [get_bd_pins sys_ps7/GPIO_T] [get_bd_ports gpio_t]
connect_bd_net [get_bd_pins sys_ps7/SPI0_MOSI_O] [get_bd_ports spi0_sdo_o]
connect_bd_net [get_bd_pins sys_ps7/SPI0_SCLK_O] [get_bd_ports spi0_clk_o]
connect_bd_net [get_bd_pins sys_ps7/SPI0_SS1_O] [get_bd_ports spi0_csn_1_o]
connect_bd_net [get_bd_pins sys_ps7/SPI0_SS2_O] [get_bd_ports spi0_csn_2_o]
connect_bd_net [get_bd_pins sys_ps7/SPI0_SS_O] [get_bd_ports spi0_csn_0_o]
connect_bd_net [get_bd_pins sys_ps7/SPI1_MOSI_O] [get_bd_ports spi1_sdo_o]
connect_bd_net [get_bd_pins sys_ps7/SPI1_SCLK_O] [get_bd_ports spi1_clk_o]
connect_bd_net [get_bd_pins sys_ps7/SPI1_SS1_O] [get_bd_ports spi1_csn_1_o]
connect_bd_net [get_bd_pins sys_ps7/SPI1_SS2_O] [get_bd_ports spi1_csn_2_o]
connect_bd_net [get_bd_pins sys_ps7/SPI1_SS_O] [get_bd_ports spi1_csn_0_o]
connect_bd_net [get_bd_pins sys_rstgen1/peripheral_aresetn] [get_bd_pins smartconnect_0/aresetn] [get_bd_pins axi_bram_ctrl_0/s_axi_aresetn]
connect_bd_net [get_bd_pins sys_rstgen/peripheral_reset] [get_bd_pins clk_wiz_1/reset]
connect_bd_net [get_bd_ports tdd_sync_i] [get_bd_pins util_ad9361_tdd_sync/sync_in]
connect_bd_net [get_bd_ports up_enable] [get_bd_pins axi_ad9361/up_enable]
connect_bd_net [get_bd_ports up_txnrx] [get_bd_pins axi_ad9361/up_txnrx]
connect_bd_net [get_bd_pins util_ad9361_adc_fifo/din_ovf] [get_bd_pins axi_ad9361/adc_dovf]
connect_bd_net [get_bd_pins util_ad9361_adc_fifo/dout_data_0] [get_bd_pins util_ad9361_adc_pack/fifo_wr_data_0]
connect_bd_net [get_bd_pins util_ad9361_adc_fifo/dout_data_1] [get_bd_pins util_ad9361_adc_pack/fifo_wr_data_1]
connect_bd_net [get_bd_pins util_ad9361_adc_fifo/dout_data_2] [get_bd_pins util_ad9361_adc_pack/fifo_wr_data_2]
connect_bd_net [get_bd_pins util_ad9361_adc_fifo/dout_data_3] [get_bd_pins util_ad9361_adc_pack/fifo_wr_data_3]
connect_bd_net [get_bd_pins util_ad9361_adc_fifo/dout_enable_0] [get_bd_pins util_ad9361_adc_pack/enable_0]
connect_bd_net [get_bd_pins util_ad9361_adc_fifo/dout_enable_1] [get_bd_pins util_ad9361_adc_pack/enable_1]
connect_bd_net [get_bd_pins util_ad9361_adc_fifo/dout_enable_2] [get_bd_pins util_ad9361_adc_pack/enable_2]
connect_bd_net [get_bd_pins util_ad9361_adc_fifo/dout_enable_3] [get_bd_pins util_ad9361_adc_pack/enable_3]
connect_bd_net [get_bd_pins util_ad9361_adc_fifo/dout_valid_0] [get_bd_pins util_ad9361_adc_pack/fifo_wr_en]
connect_bd_net [get_bd_pins util_ad9361_adc_pack/fifo_wr_overflow] [get_bd_pins util_ad9361_adc_fifo/dout_ovf]
connect_bd_net [get_bd_pins util_ad9361_adc_pack/packed_fifo_wr_data] [get_bd_pins btle_controller_0/rx_iq_signal_ext]
connect_bd_net [get_bd_pins util_ad9361_adc_pack/packed_fifo_wr_en] [get_bd_pins btle_controller_0/rx_iq_valid_ext]
connect_bd_net [get_bd_pins util_ad9361_dac_upack/fifo_rd_data_0] [get_bd_pins axi_ad9361_dac_fifo/din_data_0]
connect_bd_net [get_bd_pins util_ad9361_dac_upack/fifo_rd_data_1] [get_bd_pins axi_ad9361_dac_fifo/din_data_1]
connect_bd_net [get_bd_pins util_ad9361_dac_upack/fifo_rd_data_2] [get_bd_pins axi_ad9361_dac_fifo/din_data_2]
connect_bd_net [get_bd_pins util_ad9361_dac_upack/fifo_rd_data_3] [get_bd_pins axi_ad9361_dac_fifo/din_data_3]
connect_bd_net [get_bd_pins util_ad9361_dac_upack/fifo_rd_underflow] [get_bd_pins axi_ad9361_dac_fifo/din_unf]
connect_bd_net [get_bd_pins util_ad9361_dac_upack/fifo_rd_valid] \
  [get_bd_pins axi_ad9361_dac_fifo/din_valid_in_0] [get_bd_pins axi_ad9361_dac_fifo/din_valid_in_1] \
  [get_bd_pins axi_ad9361_dac_fifo/din_valid_in_2] [get_bd_pins axi_ad9361_dac_fifo/din_valid_in_3]
connect_bd_net -net util_ad9361_divclk_clk_out [get_bd_pins clk_wiz_1/clk_out1] \
  [get_bd_pins util_ad9361_divclk_reset/slowest_sync_clk] [get_bd_pins util_ad9361_adc_fifo/dout_clk] \
  [get_bd_pins util_ad9361_adc_pack/clk] [get_bd_pins axi_ad9361_dac_fifo/din_clk] [get_bd_pins util_ad9361_dac_upack/clk] \
  [get_bd_pins btle_controller_0/rf_clk]
connect_bd_net [get_bd_pins util_ad9361_divclk_reset/peripheral_aresetn] \
  [get_bd_pins util_ad9361_adc_fifo/dout_rstn] [get_bd_pins axi_ad9361_dac_fifo/din_rstn]
connect_bd_net [get_bd_pins util_ad9361_divclk_reset/peripheral_reset] \
  [get_bd_pins util_ad9361_adc_pack/reset] [get_bd_pins util_ad9361_dac_upack/reset] [get_bd_pins btle_controller_0/rf_rst] \
  [get_bd_pins btle_controller_0/bb_rst]
connect_bd_net [get_bd_pins util_ad9361_divclk_sel_concat/dout] [get_bd_pins util_ad9361_divclk_sel/Op1]
connect_bd_net [get_bd_pins util_ad9361_tdd_sync/sync_out] [get_bd_pins axi_ad9361/tdd_sync] [get_bd_ports tdd_sync_o]
connect_bd_net [get_bd_pins xlconcat_0/dout] [get_bd_pins btle_controller_0/gpio]
connect_bd_net [get_bd_pins xlconstant_0/dout] \
  [get_bd_pins btle_controller_0/baremetal_phy_intf_mode] [get_bd_pins util_ad9361_adc_pack/packed_fifo_wr_overflow]
connect_bd_net [get_bd_pins xlslice_0/Dout] [get_bd_pins GPIO21/Din] [get_bd_pins GPIO22/Din] [get_bd_pins GPIO19/Din] [get_bd_pins GPIO20/Din]

# ---- address map ----
assign_bd_address -offset 0x40000000 -range 4K -target_address_space [get_bd_addr_spaces sys_ps7/Data] [get_bd_addr_segs btle_controller_0/s00_axi/reg0]
assign_bd_address -offset 0x41200000 -range 64K -target_address_space [get_bd_addr_spaces sys_ps7/Data] [get_bd_addr_segs axi_gpreg/s_axi/axi_lite]
assign_bd_address -offset 0x41600000 -range 4K -target_address_space [get_bd_addr_spaces sys_ps7/Data] [get_bd_addr_segs axi_iic_main/S_AXI/Reg]
assign_bd_address -offset 0x79020000 -range 64K -target_address_space [get_bd_addr_spaces sys_ps7/Data] [get_bd_addr_segs axi_ad9361/s_axi/axi_lite]
assign_bd_address -offset 0x80000000 -range 128K -target_address_space [get_bd_addr_spaces sys_ps7/Data] [get_bd_addr_segs axi_bram_ctrl_0/S_AXI/Mem0]

validate_bd_design
save_bd_design
